# EAGLE board us_beacon_base_v3rf (EAGLE 6.5.0)
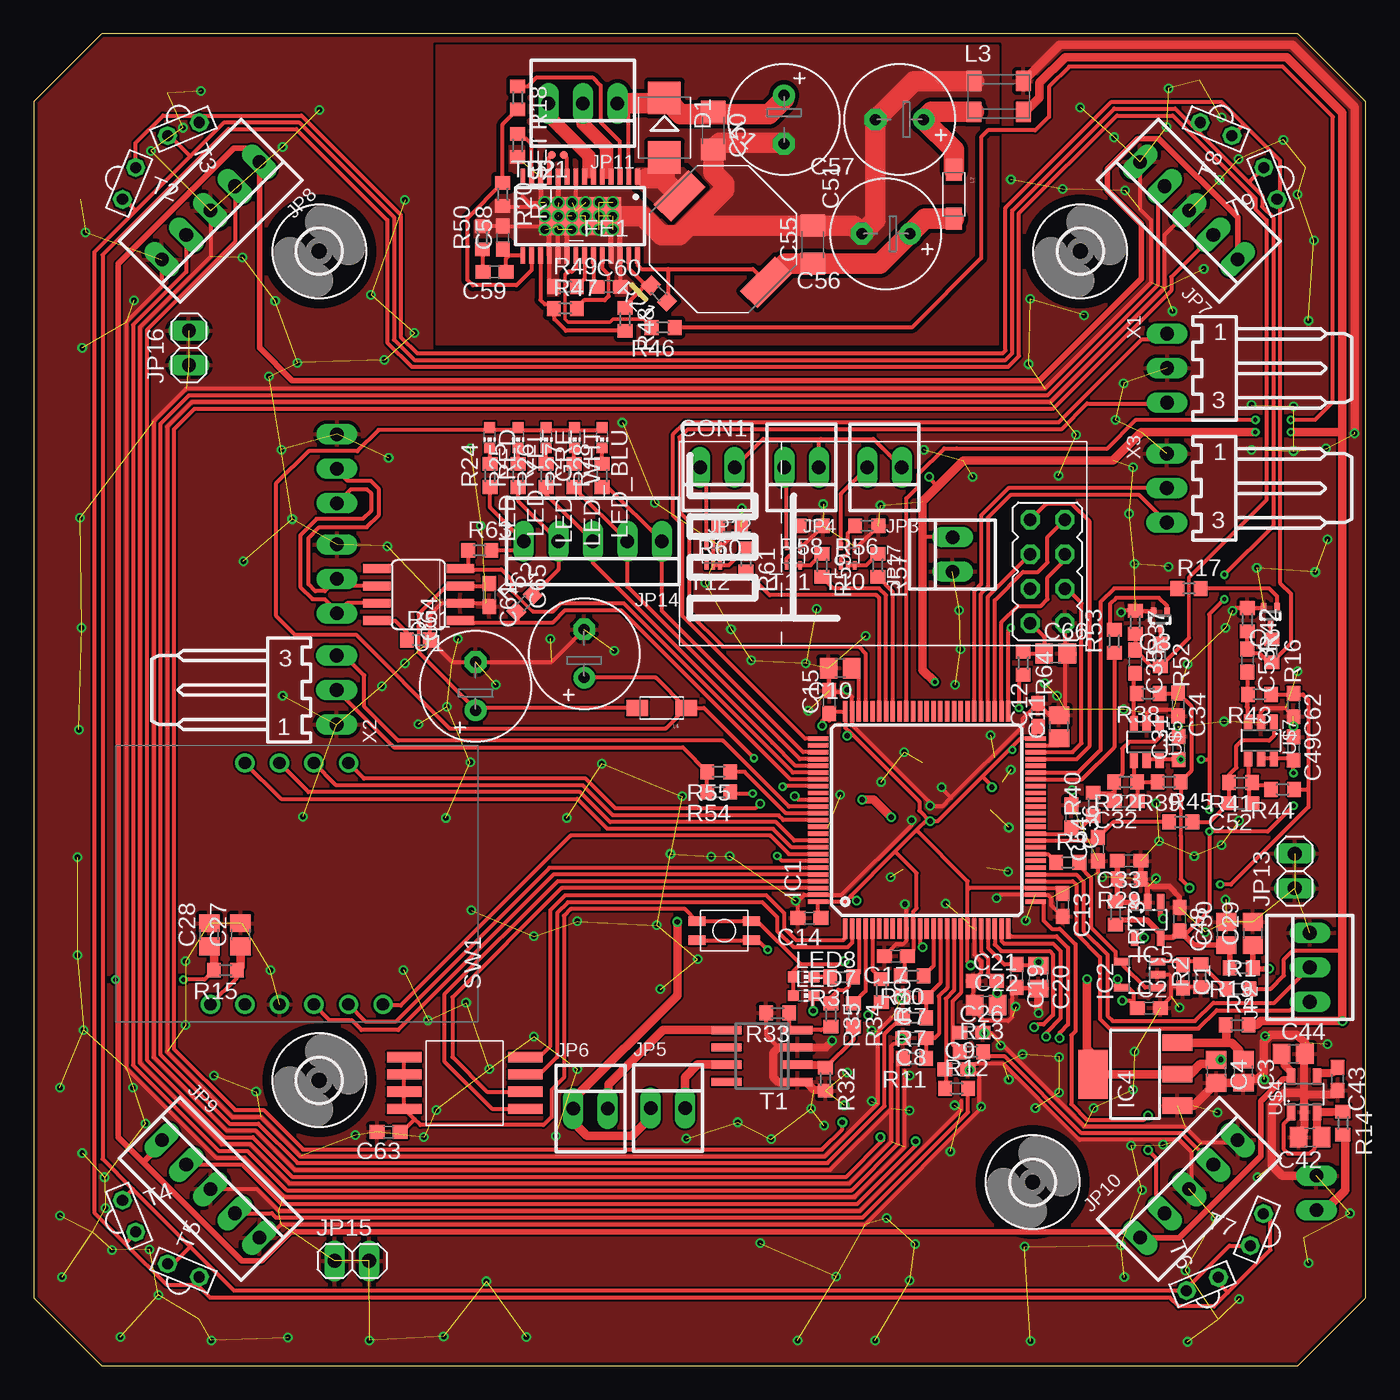
[diagram p6: board, top side]
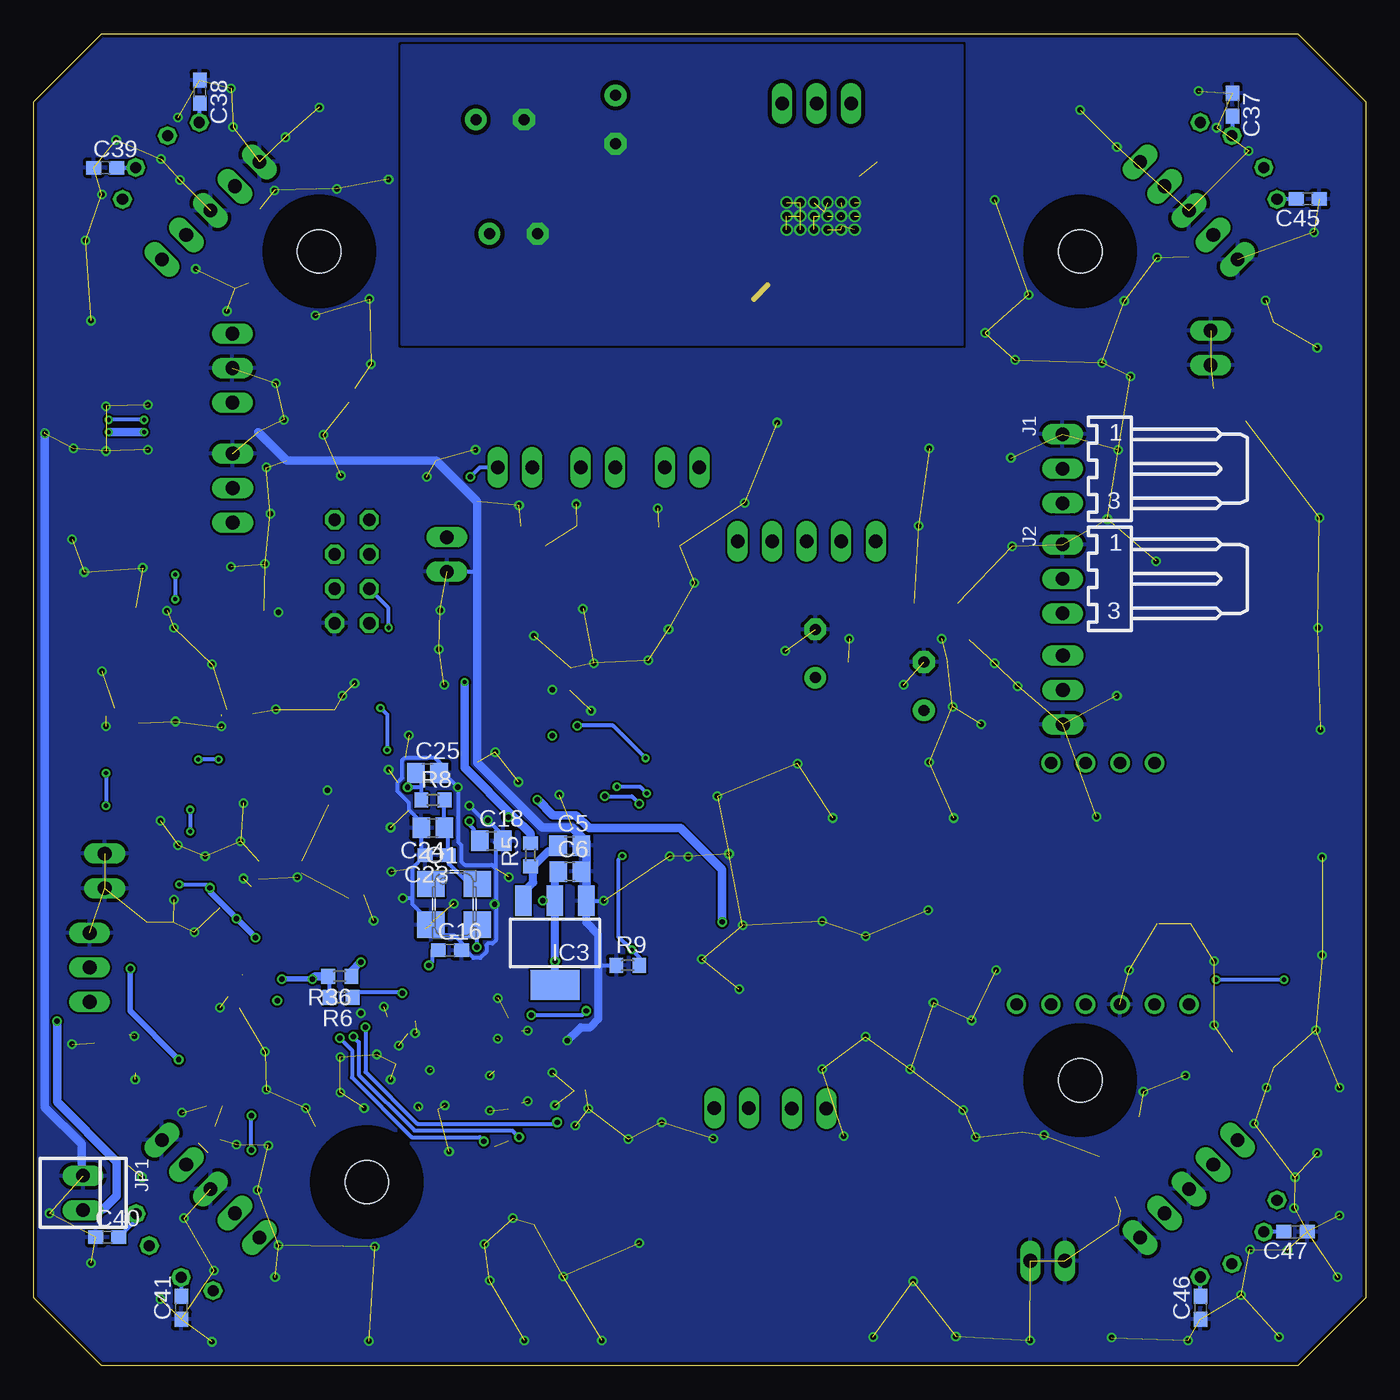
[diagram p7: board, bottom side, seen from below]

Size 98 x 98 mm. Coordinates in mm from the lower left corner, seen from the top.
Outline: 0,93 0,5 5,0 93,0 98,5 98,93 93,98 5,98 0,93
Copper layers (1*16): Top 0.035mm / dielectric 1.5mm / Bottom 0.035mm
Design rules "SeeedStudio_2layer_DRU_no_angle_20140221 *": minimum track width 6mil, minimum drill 0.3mm, track to track 6mil, track to pad 6mil, pad to pad 6mil, via to via 6mil, smd to smd 0mil, copper to edge 10mil, drill to drill 10mil, minimum pad ring 10mil, minimum via ring 6mil, stop-mask expansion 2mil, vias tented up to drill 100mil, thermal gap 10mil
Milling: 1 lines

## Footprints (pad centres in the part's own frame; a part is rotated, then mirrored left to right if it is on the bottom)
TSSOP28 = smd 0.35 x 1.2: 1 -4.225,-2.9; 2 -3.575,-2.9; 3 -2.925,-2.9; 4 -2.275,-2.9; 5 -1.625,-2.9; 6 -0.975,-2.9; 7 -0.325,-2.9; 8 0.325,-2.9; 9 0.975,-2.9; 10 1.625,-2.9; 11 2.275,-2.9; 12 2.925,-2.9; 13 3.575,-2.9; 14 4.225,-2.9; 15 4.225,2.9; 16 3.575,2.9; 17 2.925,2.9; 18 2.275,2.9; 19 1.625,2.9; 20 0.975,2.9; 21 0.325,2.9; 22 -0.325,2.9; 23 -0.975,2.9; 24 -1.625,2.9; 25 -2.275,2.9; 26 -2.925,2.9; 27 -3.575,2.9; 28 -4.225,2.9 | smd 6 x 2.8: PAD 0,0
3MMX3.5MM_BUTTON = smd 0.7 x 1.25: 1 -0.7,2; 2 0.7,2; 3 -0.7,-2; 4 0.7,-2
C0603 = smd 1.1 x 1: 1 -0.85,0; 2 0.85,0
C0805 = smd 1.3 x 1.5: 1 -0.85,0; 2 0.85,0
C1206 = smd 1.6 x 1.8: 1 -1.4,0; 2 1.4,0
E3,5-8 = drill 0.813 pad 1.6: + -1.778,0 | drill 0.813 pad 1.6 octagon: - 1.778,0
NRF24-MODULE = drill 0.914 octagon: 1 28.37,1.63; 2 25.83,1.63; 3 28.37,4.17; 4 25.83,4.17; 5 28.37,6.71; 6 25.83,6.71; 7 28.37,9.25; 8 25.83,9.25
SMB = smd 2.4 x 2.4: A 2.2,0; C -2.2,0
3,2 = hole 3.2: 0,0
TQFP100 = smd 1.5 x 0.33: 1 -8,6; 2 -8,5.5; 3 -8,5; 4 -8,4.5; 5 -8,4; 6 -8,3.5; 7 -8,3; 8 -8,2.5; 9 -8,2; 10 -8,1.5; 11 -8,1; 12 -8,0.5; 13 -8,0; 14 -8,-0.5; 15 -8,-1; 16 -8,-1.5; 17 -8,-2; 18 -8,-2.5; 19 -8,-3; 20 -8,-3.5; 21 -8,-4; 22 -8,-4.5; 23 -8,-5; 24 -8,-5.5; 25 -8,-6; 51 8,-6; 52 8,-5.5; 53 8,-5; 54 8,-4.5; 55 8,-4; 56 8,-3.5; 57 8,-3; 58 8,-2.5; 59 8,-2; 60 8,-1.5; 61 8,-1; 62 8,-0.5; 63 8,0; 64 8,0.5; 65 8,1; 66 8,1.5; 67 8,2; 68 8,2.5; 69 8,3; 70 8,3.5; 71 8,4; 72 8,4.5; 73 8,5; 74 8,5.5; 75 8,6 | smd 0.33 x 1.5: 26 -6,-8; 27 -5.5,-8; 28 -5,-8; 29 -4.5,-8; 30 -4,-8; 31 -3.5,-8; 32 -3,-8; 33 -2.5,-8; 34 -2,-8; 35 -1.5,-8; 36 -1,-8; 37 -0.5,-8; 38 0,-8; 39 0.5,-8; 40 1,-8; 41 1.5,-8; 42 2,-8; 43 2.5,-8; 44 3,-8; 45 3.5,-8; 46 4,-8; 47 4.5,-8; 48 5,-8; 49 5.5,-8; 50 6,-8; 76 6,8; 77 5.5,8; 78 5,8; 79 4.5,8; 80 4,8; 81 3.5,8; 82 3,8; 83 2.5,8; 84 2,8; 85 1.5,8; 86 1,8; 87 0.5,8; 88 0,8; 89 -0.5,8; 90 -1,8; 91 -1.5,8; 92 -2,8; 93 -2.5,8; 94 -3,8; 95 -3.5,8; 96 -4,8; 97 -4.5,8; 98 -5,8; 99 -5.5,8; 100 -6,8
SOT23-5 = smd 0.55 x 1.2: 1 -0.95,-1.3; 2 0,-1.3; 3 0.95,-1.3; 4 0.95,1.3; 5 -0.95,1.3
SOT223 = smd 1.219 x 2.235: 1 -2.311,-3.099; 2 0,-3.099; 3 2.311,-3.099 | smd 3.6 x 2.2: 4 0,3.099
7395-03 = drill 1.016 long: 1 -2.54,0; 2 0,0; 3 2.54,0
22-23-2021 = drill 1 long: 1 -1.27,0; 2 1.27,0
22-23-2031 = drill 1 long: 1 -2.54,0; 2 0,0; 3 2.54,0
22-23-2051 = drill 1 long: 1 -5.08,0; 2 -2.54,0; 3 0,0; 4 2.54,0; 5 5.08,0
1X02 = drill 1.016 long: 1 -1.27,0; 2 1.27,0
WE-TPC_1028/1038 = smd 3.6 x 1.8: 1 0,4.5; 2 0,-4.5
WE-CBF_1206(W=5.2) = smd 1.6 x 1.2: 1 -1.8,0; 2 1.8,0
WE-CNSW_1812 = smd 1.15 x 1.55: 1 -1.825,-1.125; 2 1.825,-1.125; 3 1.825,1.125; 4 -1.825,1.125
CHIP-LED0603 = smd 0.8 x 0.8: A 0,-0.75; C 0,0.75
XO53 = smd 1.93 x 2.032: 1 -1.5,-1.7; 2 1.5,-1.7; 3 1.5,1.7; 4 -1.5,1.7
SC75_INFINEON = smd 0.4 x 0.65: 1 -0.5,-0.575; 2 0,0.575; 3 0.5,-0.575
R0603 = smd 1 x 1.1: 1 -0.85,0; 2 0.85,0
416131160804 = smd 0.76 x 2.54: 1 0,-4.445; 2 1.27,-4.445; 3 2.54,-4.445; 4 3.81,-4.445; 5 3.81,4.445; 6 2.54,4.445; 7 1.27,4.445; 8 0,4.445
SO08 = smd 0.6 x 2.2: 1 -1.905,-2.6; 2 -0.635,-2.6; 3 0.635,-2.6; 4 1.905,-2.6; 5 1.905,2.6; 6 0.635,2.6; 7 -0.635,2.6; 8 -1.905,2.6
LPT80A = drill 0.813 octagon: C 0,-1.27; E 0,1.27
SOT563 = smd 0.279 x 0.6: 1 -0.5,-0.7; 2 0,-0.7; 3 0.5,-0.7; 4 0.5,0.7; 5 0,0.7; 6 -0.5,0.7
TP06R = smd 0.6 x 0.6: TP 0,0
SOIC-8 = smd 2.032 x 0.66: 1 -3.073,1.27; 2 -3.073,0; 3 -3.073,-1.27; 4 -3.073,-2.54; 5 3.073,-2.54; 6 3.073,-1.27; 7 3.073,0; 8 3.073,1.27
BNO055_BREAKOUT = drill 0.9: 3VO 9.525,1.27; ADR 17.145,19.05; GND 12.065,1.27; INT 14.605,19.05; PS0 9.525,19.05; PS1 12.065,19.05; RST 19.685,1.27; SCL 17.145,1.27; SDA 14.605,1.27; VIN 6.985,1.27
TSOT23-6 = smd 0.62 x 1.22: 1 -0.95,-1.3; 2 0,-1.3; 3 0.95,-1.3; 4 0.95,1.3; 6 -0.95,1.3
TSOT23-6' = smd 0.62 x 1.22: 1 -0.95,-1.3; 2 0,-1.3; 3 0.95,-1.3; 4 0.95,1.3; 5 0,1.3; 6 -0.95,1.3

## Placement (x,y rotation side)
_FE1  LT3599  [TSSOP28]  40.2,84.6 180 top
BT1  3MMX3.5MM_BUTTON  [3MMX3.5MM_BUTTON]  50.8,32 270 top
C1  100n  [C0603]  84.57,28.63 270 top
C2  100n  [C0603]  82.06,26.31 0 top
C3  10u  [C0805]  89.01,21.67 270 top
C4  10u  [C0805]  87.01,21.65 270 top
C5  10u  [C0805]  58.58,38.26 0 bottom
C6  10u  [C0805]  58.56,36.36 0 bottom
C7  1n  [C0603]  64.8,27.1 180 top
C8  1n  [C0603]  64.8,24.1 180 top
C9  1n  [C0603]  67.9,21.8 0 top
C10  2u2  [C0805]  59.33,51.33 180 top
C11  2u2  [C0805]  75.44,47.01 90 top
C12  100n  [C0603]  73.89,47.88 90 top
C13  100n  [C0603]  75.71,33.9 270 top
C14  100n  [C0603]  57.08,32.94 180 top
C15  100n  [C0603]  58.54,48.84 90 top
C16  100n  [C0603]  67.39,30.56 0 bottom
C17  100n  [C0603]  63.44,30.14 180 top
C18  10u  [C0805]  64.34,38.62 0 bottom
C19  100n  [C0603]  72.31,28.67 270 top
C20  10u  [C0805]  73.92,28.59 270 top
C21  100n  [C0603]  70,28.31 0 top
C22  10u  [C0805]  70.08,26.52 0 top
C23  100n  [C0603]  68.37,37.56 180 bottom
C24  10u  [C0805]  68.65,39.58 180 bottom
C25  10u  [C0805]  69.04,43.61 0 bottom
C26  1n  [C0603]  69,24.5 0 top
C27  10u  [C0805]  15.2,31.7 90 top
C28  10u  [C0805]  12.9,31.7 90 top
C29  10u  [C0805]  89.7,31.8 90 top
C30  10u  [C0805]  87.75,31.8 90 top
C31  100n  [C0603]  84.25,45.45 90 top
C32  [C0603]  80.35,41.55 180 top
C33  100n  [C0603]  80.6,37.15 180 top
C34  100n  [C0603]  84.2,48.65 270 top
C35  10n  [C0603]  81.05,51.8 270 top
C36  10n  [C0603]  76.35,40.4 270 top
C37  100n  [C0603]  9.8,92.8 270 bottom
C38  100n  [C0603]  85.8,93.75 270 bottom
C39  100n  [C0603]  92.75,88.15 0 bottom
C40  100n  [C0603]  92.6,9.45 0 bottom
C41  100n  [C0603]  87.15,4.25 90 bottom
C42  10u  [C0805]  93.92,16.81 180 top
C43  100p  [C0603]  95.94,21.09 270 top
C44  10u  [C0805]  92.68,22.94 0 top
C45  100n  [C0603]  4.25,85.85 180 bottom
C46  100n  [C0603]  12.15,4.25 90 bottom
C47  100n  [C0603]  5.15,9.85 180 bottom
C48  100n  [C0603]  84.3,32.85 270 top
C49  100n  [C0603]  92.7,45.4 270 top
C50  22u  [C1206]  50,90.9 270 top
C51  150u  [E3,5-8]  55.2,91.7 270 top
C52  [C0603]  88.8,41.4 180 top
C53  10n  [C0603]  89.3,51.9 270 top
C54  10n  [C0603]  78.3,38 90 top
C55  22u  [C1206]  57.3,82.5 90 top
C56  150u  [E3,5-8]  62.7,83.3 180 top
C57  150u  [E3,5-8]  63.7,91.7 180 top
C58  100p  [C0603]  34.5,83 90 top
C59  2n2  [C0603]  33.9,80.5 180 top
C60  2n2  [C0603]  42.3,79.4 0 top
C61  100n  [C0603]  33.5,56.7 270 top
C62  100n  [C0603]  92.7,48.6 270 top
C63  100n  [C0603]  26.1,17.2 180 top
C64  150u  [E3,5-8]  32.5,50 90 top
C65  150u  [E3,5-8]  40.5,52.4 90 top
C66  10u  [C0805]  75.2,52.4 0 top
CON1  NRF24-MODULE  [NRF24-MODULE]  47.5,53 0 top
D1  B250A-FDICT-ND  [SMB]  46.4,91.1 270 top
H5  MOUNT-HOLE3.2  [3,2]  21,21 0 top
H6  MOUNT-HOLE3.2  [3,2]  21,82 0 top
H7  MOUNT-HOLE3.2  [3,2]  77,82 0 top
H8  MOUNT-HOLE3.2  [3,2]  73.5,13.5 0 top
IC1  STM32F407VGT6  [TQFP100]  65.71,40.14 90 top
IC2  MCP6001T-I/OTCT-ND  [SOT23-5]  81.36,28.77 90 top
IC3  LM1117  [SOT223]  59.66,31.1 180 bottom
IC4  LM1117  [SOT223]  81.05,21.44 90 top
IC5  MCP6001T-I/OTCT-ND  [SOT23-5]  81.95,32.8 180 top
J1  CAN_3POLIG  [7395-03]  22.3,66 270 bottom
J2  CAN_3POLIG  [7395-03]  22.3,57.9 270 bottom
JP1  [22-23-2021]  94.38,12.7 270 bottom
JP2  [22-23-2031]  93.9,29.3 90 top
JP3  [22-23-2021]  62.6,66.1 180 top
JP4  [22-23-2021]  56.5,66.1 180 top
JP5  [22-23-2021]  46.65,18.95 0 top
JP6  [22-23-2021]  40.95,18.9 0 top
JP7  [22-23-2051]  85,85 135 top
JP8  [22-23-2051]  13,85 225 top
JP9  [22-23-2051]  13,13 315 top
JP10  [22-23-2051]  85,13 45 top
JP11  [22-23-2031]  40.4,92.9 180 top
JP12  [22-23-2021]  50.3,66.1 180 top
JP13  [1X02]  92.8,36.4 90 top
JP14  [22-23-2051]  41.13,60.67 180 top
JP15  [1X02]  23.4,7.7 0 top
JP16  [1X02]  11.4,74.9 90 top
JP17  [22-23-2021]  67.6,59.7 90 top
L1  WE-TPC_1028/1038  [WE-TPC_1028/1038]  50.7,82.9 225 top
L2  Wuert 742 792 18  [WE-CBF_1206(W=5.2)]  67.7,86.2 270 top
L3  wuerth 744 235 601  [WE-CNSW_1812]  71,93.4 180 top
L4  Wuert 742 792 18  [WE-CBF_1206(W=5.2)]  46.2,48.4 180 top
LED7  [CHIP-LED0603]  56.66,27.22 270 top
LED8  [CHIP-LED0603]  56.66,28.6 270 top
LED_BLU  [CHIP-LED0603]  41.81,68.29 180 top
LED_GRE  [CHIP-LED0603]  37.7,68.29 180 top
LED_RED  [CHIP-LED0603]  33.54,68.29 180 top
LED_WHT  [CHIP-LED0603]  39.78,68.29 180 top
LED_YEL  [CHIP-LED0603]  35.62,68.29 180 top
Q1  [XO53]  67.08,33.94 270 bottom
Q2  RUM003N02  [SC75_INFINEON]  91,55.2 180 top
Q3  RUM003N02  [SC75_INFINEON]  82.9,54.9 180 top
R1  20k  [R0603]  88.61,27.72 0 top
R2  6k8  [R0603]  85.88,28.7 90 top
R3  1k  [R0603]  76.09,37.02 0 top
R4  445-1550-1-ND  [R0603]  88.55,25.06 0 top
R5  445-1550-1-ND  [R0603]  61.46,37.58 90 bottom
R6  445-1550-1-ND  [R0603]  75.4,27.1 180 bottom
R7  50  [R0603]  64.8,25.6 180 top
R8  445-1550-1-ND  [R0603]  68.63,41.62 0 bottom
R9  560  [R0603]  54.29,29.46 0 bottom
R10  1k  [R0603]  64.63,28.69 180 top
R11  50  [R0603]  64.8,22.6 180 top
R12  50  [R0603]  67.9,20.4 0 top
R13  50  [R0603]  69,23.1 0 top
R14  445-1550-1-ND  [R0603]  96.34,17.84 270 top
R15  445-1550-1-ND  [R0603]  14.1,29.1 180 top
R16  510  [R0603]  91.1,52.6 270 top
R17  1k  [R0603]  85,57.2 0 top
R18  1Meg  [R0603]  35.6,93.3 270 top
R19  ferrite  [R0603]  88.85,29.25 180 top
R20  33k  [R0603]  34.5,86.2 270 top
R21  33k  [R0603]  46,78.9 135 top
R22  20k  [R0603]  80.35,42.95 180 top
R23  4k7  [R0603]  79.6,33.3 270 top
R24  1k  [R0603]  33.57,65.5 90 top
R25  1k  [R0603]  35.63,65.5 90 top
R26  1k  [R0603]  37.69,65.5 90 top
R27  1k  [R0603]  39.75,65.5 90 top
R28  680  [R0603]  41.81,65.5 90 top
R29  4k7  [R0603]  80.6,35.8 180 top
R30  [R0603]  62.37,27.6 270 top
R31  [R0603]  59.45,28.59 180 top
R32  100k  [R0603]  58.25,21.08 270 top
R33  100k  [R0603]  54.73,25.94 180 top
R34  1k  [R0603]  60.3,25.8 270 top
R35  1k  [R0603]  58.65,25.8 270 top
R36  445-1550-1-ND  [R0603]  75.5,28.65 180 bottom
R37  4k7  [R0603]  81.05,54.7 270 top
R38  10k  [R0603]  82,49.45 180 top
R39  10k  [R0603]  83.55,42.95 180 top
R40  1k  [R0603]  77.95,41.3 90 top
R41  20k  [R0603]  88.8,42.9 180 top
R42  4k7  [R0603]  89.3,54.9 270 top
R43  10k  [R0603]  90.2,49.4 180 top
R44  10k  [R0603]  91.9,42.4 180 top
R45  1k  [R0603]  84.4,40 0 top
R46  1k  [R0603]  46.3,76.4 180 top
R47  47k  [R0603]  39.1,77.8 0 top
R48  10k  [R0603]  43.5,77 270 top
R49  47k  [R0603]  39.1,79.4 0 top
R50  10k  [R0603]  33,83 90 top
R51  4k7  [R0603]  28.3,53.4 0 top
R52  510  [R0603]  82.9,52.3 270 top
R53  1k  [R0603]  79.5,53.3 90 top
R54  100  [R0603]  50.4,42.2 180 top
R55  100  [R0603]  50.4,43.7 180 top
R56  33  [R0603]  61.3,61.8 180 top
R57  10k  [R0603]  62.1,58.9 270 top
R58  33  [R0603]  57.2,61.8 180 top
R59  10k  [R0603]  58,58.9 270 top
R60  33  [R0603]  51.2,61.7 180 top
R61  10k  [R0603]  52.4,59.3 270 top
R62  [R0603]  36.1,56.1 45 top
R63  [R0603]  32.8,60 0 top
R64  445-1550-1-ND  [R0603]  72.8,51.7 270 top
R_ISET  27k  [R0603]  35.6,89.8 270 top
SW1  416131160804  [416131160804]  31.7,22.7 270 top
T1  IRF7313  [SO08]  53.58,22.78 90 top
T2  TEFT4300  [LPT80A]  7,87 337.5 top
T3  TEFT4300  [LPT80A]  11,91 292.5 top
T4  TEFT4300  [LPT80A]  7,11 22.5 top
T5  TEFT4300  [LPT80A]  11,7 67.5 top
T6  TEFT4300  [LPT80A]  86,6 112.5 top
T7  TEFT4300  [LPT80A]  90,10 157.5 top
T8  TEFT4300  [LPT80A]  87,91 247.5 top
T9  TEFT4300  [LPT80A]  91,87 202.5 top
T10  PMBT3904VS  [SOT563]  59.9,59.6 180 top
T11  PMBT3904VS  [SOT563]  55.9,59.6 180 top
T12  PMBT3904VS  [SOT563]  50,59.6 180 top
TP1  TPTP06R  [TP06R]  39,89.1 180 top
TP2  TPTP06R  [TP06R]  38.1,89.1 180 top
U1  SN65HVD230  [SOIC-8]  28.3,56.1 180 top
U$1  BNO055_ADAFRUIT_BREAKOUT  [BNO055_BREAKOUT]  6,25.3 0 top
U$4  AP2210K-5.0  [TSOT23-6]  93.48,19.97 0 top
U$5  MAX4488  [TSOT23-6']  81.9,45.9 180 top
U$7  MAX4488  [TSOT23-6']  90.3,46 180 top
X1  SWDABGEWINKELT  [7395-03]  83.4,73.4 270 top
X2  SERIAL_DEBUG_3PINL  [7395-03]  22.27,49.72 90 top
X3  SERIAL_DEBUG_3PINL  [7395-03]  83.38,64.57 270 top

## Tracks (layer width: path | path; a pad name or v marks a point on that pad's centre or on a via)
3V3_CAN
  Top 0.25: 28.3,54.4 28.3,52.5
  Top 0.3: C61.1 33.32,57.37 U1.3 30.37,57.37 28.3,55.3 28.3,54.4 | 28.3,52.5 32.55,48.25 32.53,48.25 C64.+ 32.68,48.4 L4.2
+3V3_ANALOG  (via drill 0.4)
  Top 0.3: IC2.5 80.53,27.82 80.9,27.45 80.9,26.62 C2.1 | 81.12,26.4 C2.1 | C2.1 80.67,26.85 v80.1,26.85
  Top 0.406: C29.1 R19.1 89.75,29.2 v90.9,29.2 | v87.35,22.5 C4.1 | v79.75,28.45 79.75,28.13 IC2.5
  Top 0.6: 86.67,22.14 C4.1 | 78.1,22.69 78.02,22 IC4.4
  Top 0.61: C4.1 86.71,22.2 85.85,22.2 85.09,21.44 IC4.2 78.58,21.44 78.02,22 | 78.1,22.69 77.5,23.29 v77.5,28.45
  Bottom 0.3: R6.2 76.25,28.55 R36.2
  Bottom 0.406: v90.9,29.2 90.9,26.1 v87.35,22.5 | v77.5,28.45 v79.75,28.45
  Bottom 0.6: 76.55,28.85 R36.2
  Bottom 0.61: v77.5,28.45 77.3,28.65 R36.2
+3V3_DIGITAL  (via drill 0.3, 0.4)
  Top 0.3: 60.12,34.58 59.69,34.14 IC1.100 57.71,32.94 C14.1 | 60.12,34.58 63.38,37.83 | 63.38,37.83 64.95,39.4 | 64.95,39.4 65.78,40.23 v65.95,40.05 | C12.1 73.71,47.31 IC1.50 72.59,46.14 71.72,45.27 | 63.38,37.83 64.95,36.25 64.95,33.65 64.71,33.41 IC1.11 64.71,30.56 C17.1 64.08,29.93 64.08,28.99 R10.2 | 68.71,35 IC1.19 68.71,29.69 v68.95,29.45 | 58.54,47.46 C15.1 58.69,48.14 IC1.75 59.71,46.94 60.08,46.58 | 71.72,45.27 69.8,43.35 | v70.5,42.55 70.5,42.65 69.8,43.35 | 68.71,35 68.85,35.14 IC1.28 75.32,35.14 C13.1 76.06,35.1 | v60.55,34.2 60.5,34.2 60.12,34.58 | LED7.A LED8.A 55.91,29.06 56.4,29.55 | 60.08,46.58 65.15,41.5 65.15,40.85 v65.95,40.05 | v59.85,46.35 60.08,46.58 | 56.4,29.55 59.45,29.55 v59.65,29.75 | 69.8,43.35 66.5,40.05 v65.95,40.05 | 68.71,35 68.71,35.64 64.95,39.4 | SW1.1 SW1.2 SW1.3 SW1.4 28.02,18.12 | v53,44.7 49.3,48.4 L4.1 | 56.4,29.55 53.25,32.7 BT1.1 BT1.3 47.9,33.6 39.5,33.6 39,33.1 39,21.2 38.1,20.3 38.1,18.3 37.5,17.7 28.45,17.7 28.02,18.12 | C63.1 27.1,17.2 28.02,18.12 | 35.6,68.85 33.73,68.85 | 33.73,68.85 LED_RED.A | L4.1 45.78,50.62 C65.+ | 33.73,68.85 25.35,68.85 23.8,67.3 20.2,67.3 17.8,64.9 17.8,55.2 19.2,53.8 23.7,53.8 30.6,46.9 46.5,46.9 L4.1 | R64.2 72.5,50.55 v72.5,48.4 | v72,45.3 71.72,45.27
  Top 0.305: 37.65,68.85 35.6,68.85 arc90 35.62,68.87 LED_YEL.A | 37.65,68.85 39.59,68.85 arc90 LED_WHT.A 39.97,68.85 41.62,68.85 LED_BLU.A 42,68.85 | LED_GRE.A 37.7,68.9 arc-90 37.65,68.85 | 58.69,48.14 58,47.45 v58,47.1
  Bottom 0.3: C25.1 69.48,43.62 R8.1 69.48,42.55 v70.5,42.55 | 65.54,38.84 C18.1 65.65,39.08 65.65,39.5 65.95,39.8 v65.95,40.05 | C16.1 68.69,30.56 68.69,29.71 v68.95,29.45 | IC3.2 v60.55,34.2 | IC3.4 v59.66,29.74 v59.65,29.75 | v53,44.7 55.4,47.1 v58,47.1 | v72.5,48.4 72,47.9 v72,45.3
  Bottom 0.305: v58,47.1 57.95,47.05
  Bottom 0.6: IC3.4 IC3.2 59.66,36.11 C6.1
+5V  (via drill 0.3)
  Top 0.3: R15.2 12.55,28.4 v11,28.4 | v6,28.4 6.2,28.4
  Top 0.406: JP7.1 88.59,84.51 82.8,90.3 81.25,90.3 79,88.05 79,86.5 81.5,84 81.5,80 74,72.5 19,72.5 16.59,74.91 JP8.1 15.58,89.6 14.7,89.6 6.2,81.1 6.2,28.4 6.2,16.8 8.05,14.95 | JP9.1 9.41,16.31 8.05,14.95 | U$4.6 92.36,21.1 91.95,21.1 90.3,19.45 90.3,15.4 84.31,9.41 JP10.1 80.97,9.85 18.9,9.85 16.75,7.7 15.3,7.7 8.05,14.95
  Top 0.6: U$4.6 92.53,21.62 92.05,22.1 92.05,22.97 C44.1
  Top 0.61: R15.2 13.25,30.5 C28.1 12.85,30.8
  Bottom 0.3: v11,28.4 v6,28.4
+UB  (via drill 0.3, 0.4)
  Top 0.3: R1.2 91.02,27.72 92,28.7 92,29.9 92.65,30.55 96.3,30.55 | JP12.1 53.67,68.2 57.9,68.2 | 57.9,68.2 61.77,68.2 JP3.1 | JP4.1 57.77,68.07 57.9,68.2 | 96.3,30.6 96.3,30.5 | JP17.2 65.43,60.97 65.4,61
  Top 0.305: v65.9,65.4 65.9,65.3 66.5,64.7
  Top 0.61: JP1.2 94.55,11.6 95.2,11.6 96.5,12.9 96.5,16.83 R14.2 | R4.2 90.01,25.06 90.3,25.35 v96.3,25.35 96.3,30.5 96.3,30.55 | v63.1,40.35 61.8,41.65 v60.95,41.65 | L3.4 72.97,92.28 74,93.3 74,94.4 75.9,96.3 92.2,96.3 96.3,92.2 96.3,68.7 | 96.3,68.7 96.3,30.6 | v66.3,50.3 65.4,51.2 65.4,61 65.4,63.6 66.5,64.7 68.4,66.6 79.4,66.6 81.5,68.7 v89.9,68.7 | v92.5,68.7 96.3,68.7 | JP5.1 45.38,18.28 44,16.9 40.7,16.9 39.7,17.9 39.7,18.88 JP6.1 39.68,19.58 47.35,27.25 v47.35,32.65 47.35,32.7
  Bottom 0.3: JP3.1 63.9,66.1
  Bottom 0.305: 63.9,66.1 65.2,66.1 v65.9,65.4
  Bottom 0.61: R5.2 61.46,39.16 62.69,40.38 | JP1.2 94.31,11.5 92.9,11.5 91.9,12.5 91.9,15 96.3,19.4 v96.3,25.35 | 62.69,40.38 62.72,40.35 v63.1,40.35 | v60.95,41.65 59.8,40.5 58.1,40.5 57.15,39.55 50.4,39.55 47.35,36.5 v47.35,32.65 | 62.69,40.38 66.3,44 v66.3,50.3 | v89.9,68.7 v92.5,68.7
ADC_BAT
  Top 0.3: IC1.33 74.62,37.64 R3.1
ADC_OPTO_SYNC_BACK
  Top 0.3: IC1.35 78.09,38.64 C54.2 79.45,40 R45.1
ADC_OPTO_SYNC_FRONT
  Top 0.3: IC1.36 75.94,39.14 C36.2 77.05,39.55 R40.1
ADR  (via drill 0.4 pad 0.4)
  Top 0.3: IC1.85 56.26,41.64 v56,41.9 | v53.45,41.35 53.1,41 42.8,41 40.6,43.2 24.3,43.2 U$1.ADR
  Bottom 0.3: v56,41.9 54,41.9 v53.45,41.35
AMP1  (via drill 0.4 pad 0.4)
  Top 0.3: IC1.23 70.71,30.99 71.2,30.5 74.75,30.5 75,30.25 75,25.8 74.3,25.1 73.8,25.1 v73.6,24.9 | v59.5,17.9 59.5,17.4 58,15.9 19.8,15.9 16.9,18.8 14.8,18.8 10.3,23.3 10.3,68.9 11.8,70.4 75,70.4 83.7,79.1 83.7,80.11 JP7.2
  Bottom 0.3: v73.6,24.9 73.6,21.6 69.8,17.8 59.6,17.8 v59.5,17.9
AMP2  (via drill 0.4 pad 0.4)
  Top 0.3: IC1.24 71.21,31.24 71.4,31.05 75,31.05 75.55,30.5 75.55,25.55 74.5,24.5 v74.5,24.2 | JP8.2 14.8,82.7 8.3,76.2 8.3,22.5 14,16.8 16.1,16.8 19,13.9 59.8,13.9 62.5,16.6 | v62.3,16.8 62.3,16.4
  Top 0.305: 62.5,16.6 v62.3,16.8
  Bottom 0.3: v74.5,24.2 74.1,23.8 74.1,21.4 70,17.3 62.8,17.3 v62.3,16.8
AMP3  (via drill 0.4 pad 0.4)
  Top 0.3: IC1.25 71.71,31.79 71.9,31.6 75.25,31.6 76.1,30.75 76.1,25.1 75.5,24.5 v75.5,24.1 | JP9.2 15.3,14.8 18.2,11.9 60.6,11.9 64.9,16.2 v64.9,16.5
  Bottom 0.3: v75.5,24.1 74.6,23.2 74.6,21.2 70.2,16.8 65.2,16.8 v64.9,16.5
AMP4  (via drill 0.4 pad 0.4)
  Top 0.3: IC1.26 74.16,34.14 74.3,34 74.3,32.75 74.9,32.15 75.5,32.15 76.65,31 76.65,24.6 76.35,24.3 76.35,19.25 77.5,18.1 81.7,18.1 v82,18.4 | JP10.2 82.6,11.81 82.6,15.25 v82,15.85
  Bottom 0.3: v82,15.85 v82,18.4
DAC1/I2S1_WS
  Top 0.3: IC1.29 76.46,35.64 76.7,35.4 76.7,31.8 78.45,30.05 78.45,25.5 79.15,24.8 85.7,24.8 87.05,26.15 92.45,26.15 93.06,26.76 JP2.1 93.86,26.8 92.6,26.8
DAC2/SPI1_SCK
  Top 0.3: IC1.30 76.71,36.14 77.25,35.6 77.25,32 79,30.25 79,25.75 79.4,25.35 85.45,25.35 86.8,26.7 91.3,26.7 JP2.2
DCDC_SW_NODE
  Top 0.3: 45.1,87.4 45,87.5 _FE1.1
  Top 1.5: D1.A 46.4,87.2 L1.2 46.2,87.4 45.1,87.4
  pour Top (no thermals): 46.5,84.8 44.45,86.85 44.45,88.1 47.75,88.1 48.75,87.1 48.75,87.05
GND  (via drill 0.4, 0.4 pad 0.4)  (270 unrouted)
  Top 0.3: 59.85,49.55 60.21,49.19 IC1.74 60.21,47.19 65.95,41.45 v65.95,41.2 66.9,41.2 67.5,41.8 | 59.85,49.55 58.68,49.55 C15.2 58.54,51.19 C10.2 | C14.2 56.23,34.18 | 56.23,34.18 56.69,34.64 IC1.99 59.44,34.64 64.6,39.8 v64.6,40.15 | C11.2 74.81,47.81 C12.2 72.75,47.59 72.75,47.05 67.5,41.8 | 67.5,41.8 66.8,42.5 v66.8,42.55 | C17.2 63.45,31 63.95,31 64.21,31.26 IC1.10 64.21,33.59 v64.1,33.95 | C13.2 75.15,33.6 74.85,33.9 74.85,34.4 74.61,34.64 IC1.27 71.09,34.64 v70.85,34.4 | 55,23.4 56.16,23.4 T1.3 | C11.2 | v56.05,34.2 56.25,34.21 56.23,34.18 | R33.2 53.88,24.32 54.8,23.4 | v59.85,49.75 59.85,49.55 | C61.2 33.25,56.1 U1.2 30,56.1 29.15,55.25 R51.2 30.77,51.78 C64.- 38.1,51.78 C65.- | IC1.20 69.21,30.24 69.7,29.75 69.7,28.91 C21.1 69.1,26.55 C22.1 69.35,26.3 69.35,25.95 69.95,25.35 71.7,25.35 72,25.65 72,27.51 C19.2 | C20.2 72.39,27.74 C19.2 | C19.2 72.31,27.61 | C2.2 82.91,26.36 83.7,27.15 83.7,27.9 | 83.7,27.9 83.7,28.1 | 83.7,28.1 83.7,28.6 83.55,28.75 82.68,28.75 | 83.72,28.08 83.7,28.1 | R2.1 84.5,27.85 | 84.5,27.85 83.75,27.85 83.7,27.9 | C1.2 84.5,27.85 | JP8.5 9.41,79.41 6.8,76.8 6.8,21.9 13.4,15.3 15.5,15.3 18.4,12.4 60.4,12.4 64.1,16.1 64.1,21.7 | JP8.3 13,81.6 7.8,76.4 7.8,22.3 13.8,16.3 15.9,16.3 18.8,13.4 60,13.4 63.1,16.5 63.1,18.9 | JP9.5 16.9,9.1 18.2,10.4 61.2,10.4 69.6,18.8 69.6,21.3 69.4,21.5 69.1,21.5 v68.85,21.75 69.3,22.2 71.35,22.2 76.95,16.6 84.3,16.6 85.2,15.7 85.2,13.2 JP10.3 | JP9.3 16.4,13 18,11.4 60.8,11.4 68.25,18.85 68.25,19.45 | JP10.5 88.4,16.4 85.9,16.4 84.7,17.6 77.3,17.6 70.45,24.45 v69.95,24.45 | 63.1,18.9 63.1,23.5 63.3,23.7 63.5,23.7 v63.85,24.05
  Top 0.3: 63.1,18.9 58.6,14.4 19.2,14.4 16.3,17.3 14.2,17.3 8.8,22.7 8.8,69.5 11.2,71.9 74.4,71.9 82.2,79.7 82.2,84.3 81.41,85.09 JP7.5 | 63.1,25.6 62.1,24.6 62.1,19.3 58.2,15.4 19.6,15.4 16.7,18.3 14.6,18.3 9.8,23.1 9.8,69.1 11.6,70.9 74.8,70.9 83.2,79.3 83.2,83.2 JP7.3 | U$5.2 81.9,48 82.2,48.3 83.8,48.3 84.2,47.9 84.2,46.95 C31.2 | Q2.3 90.58,55.75 R42.1 88.4,55.75 v88.2,55.55 | U$7.2 90.3,48.1 90.6,48.4 92.1,48.4 92.7,47.8 C49.1 | Q3.3 81.12,55.48 R37.1 80.1,55.55 v80,55.45 | C36.1 76.35,42.3 v76.4,42.35 | C54.1 78.3,36.25 v78.6,35.95 | T10.1 60.65,60.3 R56.1 | T11.1 56.55,60.3 R58.1 | T12.1 50.65,60.3 R60.1 | CON1.1 75.87,52.5 | 75.87,52.5 75.87,48.29 C11.2 | C66.2 75.95,52.5 75.87,52.5
  Top 0.406: C48.1 84.3,34.5 83.55,35.25 82,35.25 | 82,35.25 R29.1 C33.1 | IC5.2 81.95,35.2 82,35.25
  Top 0.6: 56.16,20.85 56.85,20.85 57.4,20.3 58.18,20.3 R32.2 | 56.16,23.4 54.8,23.4 54.4,23 54.4,21.25 54.8,20.85 56.16,20.85 | 56.16,20.85 T1.1 | T1.3 58.27,23.41 v58.75,23.9 | 93.55,19.8 93.48,19.73 U$4.2 93.48,17.22 C42.2 | 93.55,19.8 93.7,19.95 95.65,19.95 C43.2 | 93.45,19.9 93.55,19.8 | C44.2 93.45,23.11 93.45,19.9 | 73.92,27.42 C20.2 | 93.3,20.05 93.45,19.9
  Top 0.61: L3.1 75.5,97.2 92.6,97.2 97.2,92.6 v97.2,68.6 | C44.2 93.5,23.22 93.55,23.75 92.95,24.35 91,24.35 90.5,23.85 90.5,21.55 90.05,21.1 89.29,21.1 C3.2 88.99,20.8 C4.2 85.34,19.13 IC4.1 | 93.3,20.05 92.05,20.05 91.1,19.1 91.1,14.73 91.86,13.97 JP1.1 | 73.92,27.42 73.92,25.98 v73.95,25.95 | C27.2 15.31,32.55
  Bottom 0.3: v65.95,41.2 64.9,40.15 v64.6,40.15 63.79,39.34 C18.2 | 64,36.55 64.3,36.85 66.3,36.85 66.55,37.1 66.55,38.3 66.75,38.5 66.75,42.5 v66.8,42.55 67.74,43.49 C25.2 67.74,43.91 67.7,43.95 68.5,44.75 70.7,44.75 70.9,44.55 70.9,43.25 71.25,42.9 71.25,42.25 70.4,41.4 70.4,40.9 69.85,40.35 69.85,39.6 69.83,39.58 C24.2 69.5,37.5 69.6,37.5 | 64,36.55 64,34.15 | 64,34.15 64,31.3 64.25,31.05 64.6,31.05 64.7,30.95 64.7,30.45 65.15,30 65.65,30 66.15,30.5 | 66.15,30.5 66.15,30.75 67.05,31.65 67.99,31.65 Q1.2 68.78,32.58 70.15,33.95 70.15,34.4 | 70.15,34.4 70.15,36.63 C23.2 | v64.1,33.95 64,34.15 | 64,36.55 64,38.4 64.1,38.5 | C16.2 66.21,30.56 66.15,30.5 | IC3.1 56.25,34.2 v56.05,34.2 | v70.85,34.4 70.15,34.4 | 57.25,37.5 57.35,37.4 | R9.1 55.2,29.4 56.45,29.4 | JP17.1 65.47,58.43 65.4,58.5
  Bottom 0.6: 57.35,36.25 57.35,35.39 IC3.1 57.35,32.6 56.45,31.7 56.45,29.4 56.45,25.5 57.05,24.9 57.75,24.9 v58.75,23.9 | 57.35,36.25 57.35,37.4 57.35,37.88 C5.2 | C6.2 57.46,36.36 57.35,36.25
  Bottom 0.61: 57.35,35.39 57.35,37.4 57.35,38.55 58.4,39.6 60.6,39.6 65.4,44.4 65.4,58.5 65.4,63.6 68.4,66.6 79.4,66.6 81.5,68.7 | JP1.1 94.5,14.09 94.5,16.3 97.2,19 97.2,68.7
  other vias: 51.2,37.5 57.2,18.9 59.85,21.55 51.8,17.9 46.1,27.7 45.85,32.4 48.85,29.9 46.85,37.65 49.85,37.45 17.3,72.8 17.75,78.35 64.05,45.15 62.35,42.95 59.35,42 70.4,46.4 71.9,43.85 71.7,36.35 67.1,34 63.05,35.95 71.75,39.6 63.85,27.05 15.35,81.55 11.15,29.75 11.15,25.05 13.25,21.35 16.35,20.15 48,16.7 54.25,16.65 58.15,17.65 59.65,19.15 61.65,24.65 61.65,19.45 64.45,21.35 64.45,18.75 67.75,19.15 87.25,87.25 83.35,91.15 7.35,78.4 7.3,20.45 8.2,17.8 53.45,9 64.85,8.95 80,8.85 86.95,10.85 90.05,13.85 62.75,10.85 67.45,15.75 73.7,18.95 80.75,16.2 83.1,16.25 81.55,12.9 71.75,21.05 69.7,19.05 71.15,23.55 72.75,22.9 72.25,26.4 3.55,74.9 91.95,90.2 87.4,91.85 88.65,88.8 93,86.2 94.2,82.8 3.65,24.7 1.9,20.45 3.55,15.65 1.9,11.05 2.05,6.5 6.35,2.1 5.75,8.5 9.15,5.2 13.05,1.85 36.25,2.1 30.15,2.15 18.7,2.05 24.7,1.85 33.3,6.2 59.05,6.55 64.45,6.25 56.2,1.85 61.9,1.85 73.35,1.8 84.9,1.75 88.7,4.9 93.8,7.55 84.3,26.35 90.6,24.25 95.2,23.65 90.55,21.05 75.45,22.7 75.45,20.1 78,18.95 80.9,20.3 81,23.1 73,32.75 84.75,7 80.25,6.5 72.9,8.75 8.5,8.55 5.25,11.6 5.2,13.85 8.6,89.4 10.95,91.1 96.85,11.2 84.2,47.05 92.7,47.05 82.6,35.85 23.65,16.95 52.1,63.1 58.1,63.4 62.3,63.3 40,21.8 40,32.7 36.8,31.6 31.8,26.7 33.5,21.8 36.8,24.2 38.4,16.9 28.7,16.8 29.6,18.8 29,25.4 3.2,30.2 3.2,37.4 3.3,46.8 3.5,54.3 3.4,62.4 3.8,83.4 18.3,89.7 24.8,78.8 25.8,74 19.4,73.8 12.3,93.8 21,92.4 27.3,85.8 28,76 73.2,73.7 73.3,78.5 77.3,77.3 75.7,86.6 79.5,90.4 80.3,86.5 86.1,80.7 71.9,87.3 77,92.6 83.5,94 93.8,76.9 92.7,70.6 89.6,70.7 89.6,67.4 92.7,67.3 83.8,77.6 80.2,72.3 79.6,69.6 76.7,68.5 65.5,67.4 80.9,66.1 69.1,65.4 75.4,65.5 95.1,67.5 95.2,60.8 90,58.7 80.6,62.7 87.7,54.3 84.9,51.6 87.6,47.4 93,51.1 94.3,58.4 83.5,58.8 81,59 75.3,49.3 74.4,50.2 68.2,52.7 80.2,48.3 82.6,41.4 88.7,40.1 87.4,38.3 85.4,37.5 82.8,38.6 87.7,34.3 86.2,31.9 87.1,18.6 39.2,40.3 30.3,40.3 19.8,40.4 17.4,29.1 27.2,29.1 32.2,33.5 18.3,49.3 15.4,59.2 19,62.3 18.2,67.4 26.1,66.8 26,60.3 32.1,67.5 32.9,61.8 43.3,69.4 45.7,63.5 34,50.1 42.7,52.6 31.2,53.5 38,53.5 25.6,50 28.3,47.2 27.3,51.7 30.4,48.5 47.7,41.9 41.8,44.3 32.1,44.4 57,48.2 52.8,51.9 56.8,51.7 49.4,57.6 51.3,54.2 57.6,55.7 61.2,53.7 67.8,50.1 68.1,55.6
  pour Top (isolate 0.1, rank 3): -1,99 -1.5,-1.5 98.5,-1.5 99,99
  pour Bottom (isolate 0.1, rank 3): -1,99 -1.5,-1.5 98.5,-1.5 99,99
GNDI  (via drill 0.6)  (18 unrouted)
  Top 0.3: _FE1.26 43.12,79.42 C60.2 | _FE1.19 38.58,83.9 | 38.58,83.9 38.58,84.08 39.1,84.6 | _FE1.18 37.92,79.72 R49.1 | _FE1.8 39.88,84.92 _FE1.PAD | 35.98,86.03 36.4,85.6 37.27,85.6 | 35.98,88.58 R_ISET.2 | 38.58,83.9 38.52,83.85 C58.2 R50.2 | R20.2 34.55,85.3 38.58,85.3
  Top 0.35: _FE1.26 43.12,84.6 v42.6,84.6 42.48,84.6 | 42.48,84.6 _FE1.PAD 39.23,84.6 | _FE1.25 42.48,84.6 | _FE1.20 39.23,84.6 | _FE1.18 37.92,84.6 | 37.92,84.6 38.58,84.6 | _FE1.10 38.58,85.3 38.58,84.6 | 38.58,84.6 39.1,84.6 39.23,84.6 | _FE1.12 37.27,85.6 37.27,84.6 37.92,84.6
  Top 1.5: 48.2,83.9 50.8,86.5 50.8,87 50,87.8 C50.2 50.5,90 55.12,90 C51.- | v42.6,84.6 44.8,84.6 46.2,83.2 47.5,83.2 48.2,83.9 | 48.2,83.9 C55.2 60.32,83.9 C56.- 61.92,84.3 C57.- 64.75,94.53 L3.2
  other vias: 37.6,85.6 38.6,85.6 39.6,85.6 40.6,85.6 41.6,85.6 42.6,85.6 37.6,84.6 37.6,83.6 38.6,84.6 38.6,83.6 39.6,84.6 39.6,83.6 40.6,84.6 40.6,83.6 41.6,84.6 41.6,83.6 42.6,83.6
  pour Top (isolate 0.3, rank 2, no thermals): 70.9,97.1 70.9,75.2 29.7,75.2 29.7,97.1
  pour Bottom (isolate 0.3, rank 2, no thermals): 70.9,97.1 70.9,75.2 29.7,75.2 29.7,97.1
INT
  Top 0.3: IC1.88 55.16,40.14 54.8,40.5 42.6,40.5 40.4,42.7 22.25,42.7 U$1.INT
IO4
  Top 0.3: JP14.4 38.59,58.59 R62.2
  Top 0.305: JP14.4 35.63,63.63 R25.1
IO4/CANTX
  Top 0.3: IC1.82 55.66,43.14 43.2,55.6 39.1,55.6 38.2,54.7 35.6,54.7 | U1.1 31.5,54.7 35.6,54.7 | R62.1 35.6,55.5 35.6,54.7
IO5
  Top 0.3: R63.2 35.38,60 JP14.5
  Top 0.305: JP14.5 33.57,63.15 R24.1
IO5/CANRX
  Top 0.25: 36.7,55.5 35.2,57
  Top 0.3: IC1.81 55.86,43.64 43.4,56.1 38.8,56.1 38.2,55.5 36.7,55.5 | U1.4 31.41,58.6 31.9,58.6 | 31.9,58.6 34.4,58.6 35.2,57.8 35.2,57 | R63.1 31.95,58.65 31.9,58.6
IO_LED3
  Top 0.3: 37.43,64.39 R26.1 | 54.35,45.85 41.13,59.07 JP14.3
  Top 0.305: IC1.80 56.06,44.14 54.35,45.85 | JP14.3 37.69,64.11 R26.1
IO_LED4
  Top 0.3: 39.97,64.43 R27.1 | 54.9,46.1 43.67,57.33 JP14.2
  Top 0.305: IC1.79 56.36,44.64 54.9,46.1 | JP14.2 39.75,64.59 R27.1
IO_LED5
  Top 0.3: 55.45,46.3 46.21,55.54 JP14.1
  Top 0.305: IC1.78 56.61,45.14 55.45,46.3 | JP14.1 42.23,64.65 R28.1
IR_AMP_BACK
  Top 0.3: R17.1 79.5,57.2 78.5,56.2 78.5,45.3 76.84,43.64 IC1.45
IR_AMP_FRONT
  Top 0.3: R53.1 79.5,45.5 77.14,43.14 IC1.44
IR_OPV_3V3  (via drill 0.3)
  Top 0.3: 6.73,8.98 7.49,9.74 T4.C | 6.73,8.98 9.75,5.95 12,5.95 12.95,5 83.6,5 84.25,4.35 86.85,4.35 87.88,5.38 91,8.5 91,10.66 T7.C | U$7.5 U$7.6 92.25,44.7 C49.2 v92.7,43.6 | C31.1 84.25,44.85 84,44.6 C31.1 | C31.1 v84.4,44.6 U$5.6 U$5.5 | 7.5,85 4.45,81.95 4.45,11.25 6.73,8.98 | 7.5,85 11.5,89 | 11.5,89 14,91.5 19.5,91.5 26.5,84.5 26.5,75.5 28,74 71.5,74 72,74.5 72,85 79.5,92.5 84,92.5 85.5,91 | 7.5,85 6.67,85.83 T2.C | 11.5,89 9.99,90.51 T3.C | 85.5,91 89.5,87 | 89.5,87 90.4,86.1 90.4,85.3 91.2,84.5 91.2,61.8 v87.6,58.2 | 12,6.51 T5.C | v87.6,56.4 86.5,55.3 86.5,44.5 | 86.5,44.5 v86.5,40.9 | 84.65,31.65 86.5,33.5 v86.5,39.3 90.8,39.3 v92.7,41.2 | v85.9,44.6 86.4,44.6 86.5,44.5 | T8.C 85.5,91.16 85.5,91 | 89.5,87 89.5,87.16 T9.C | 87.17,6.08 T6.C
  Top 0.305: 12,6.51 12,5.95 | 87.17,6.08 87.88,5.38
  Top 0.406: R23.2 79.95,32.8 81.9,32.8 82.9,31.8 IC5.5 83.8,31.5 C48.2 84.65,31.65 85.35,30.95 C30.1 88,30.7 R19.2
  Bottom 0.3: C45.2 5.12,85.83 T2.C | T4.C 6.02,9.83 C47.2 | T5.C 12.17,5.12 C46.2 | 85.83,92.87 T8.C | v87.6,58.2 v87.6,56.4 | v86.5,40.9 v86.5,39.3 | v84.4,44.6 v85.9,44.6 | v92.7,43.6 v92.7,41.2 | 91.88,88.17 T9.C
  Bottom 0.305: C39.2 91.88,88.17 | C40.2 90.49,10.71 T7.C | T6.C 87.15,6.46 C41.2 | 12.15,6.49 T5.C | 85.83,92.87 C38.2 | C37.2 9.8,90.54 T3.C
IR_VIRTUAL_GND  (via drill 0.3, 0.4)
  Top 0.25: 84.4,41 84.4,39
  Top 0.3: R38.1 84.15,49.45 C34.1 85.2,48.5 85.2,43.8 84.4,43 R39.1 84.4,41 | R43.1 92.65,49.4 | 92.65,49.4 C62.1 | 92.65,49.4 93.4,49.4 93.8,49 93.8,42.5 | 93.8,42.5 93.8,41.1 88.1,35.4 v87.3,35.4 | 84.4,39 84.4,35.8 v85.05,35.15 | R44.1 93.7,42.4 93.8,42.5
  Top 0.406: IC5.4 v81.7,31.5 | v83.1,32.9 82.9,33.1 IC5.1
  Bottom 0.3: v87.3,35.4 85.3,35.4 v85.05,35.15
  Bottom 0.406: v81.7,31.5 v83.1,32.9 85.05,34.85 v85.05,35.15
LED_EN  (via drill 0.3)
  Top 0.3: 64.21,54.06 64.21,63.81 | 67.9,67.5 79,67.5 81.1,69.6 v89.9,69.6 | v92.5,69.6 94.3,69.6 95.6,70.9 95.6,91.9 91.9,95.6 76.2,95.6 74.7,94.1 74.7,91.9 73.7,90.9 70.2,90.9 69.7,90.4 69.7,81.5 64.6,76.4 R46.1
  Top 0.305: IC1.66 64.21,54.06 | 64.21,63.81 65.1,64.7 65.1,65.6 67,67.5 67.9,67.5
  Bottom 0.3: v89.9,69.6 v92.5,69.6
LED_GREEN
  Top 0.3: IC1.69 62.71,56.69 62.2,57.2 58.85,57.2 R59.2
LED_RED
  Top 0.3: IC1.68 63.21,56.94 R57.2
LED_YELLOW
  Top 0.3: IC1.70 62.21,56.49 62,56.7 54.15,56.7 R61.2
MIC1
  Top 0.3: IC1.15 66.71,28.16 C7.1 R7.1
MIC2
  Top 0.3: IC1.16 67.21,27.81 66.6,27.2 66.6,24.4 66.3,24.1 C8.1 R11.1
MIC3
  Top 0.3: IC1.17 67.71,27.61 67.1,27 67.1,21.8 | 67.1,21.8 67.1,20.45 R12.1 | C9.1 67.1,21.8
MIC4
  Top 0.3: IC1.18 68.21,27.41 67.6,26.8 67.6,24.6 | 67.6,24.6 67.6,23.65 R13.1 | C26.1 67.7,24.5 67.6,24.6
N$1
  Top 0.3: X1.3 83.34,70.8 77.5,70.8 75.6,68.9 48.1,68.9 47.5,68.3 47.5,62.8 48.2,62.1 48.2,55.4 50.7,52.9 60.7,52.9 61.21,52.39 IC1.72
N$2
  Top 0.3: X1.1 82.96,75.5 81.5,75.5 75.4,69.4 47.9,69.4 47,68.5 47,62.6 47.7,61.9 47.7,55.2 56.76,46.14 IC1.76
N$3
  Top 0.3: IC2.1 81.78,27.82 80.15,29.45 80.15,29.63 IC2.4 79.6,29.72 79.6,30.45 77.8,32.25 77.8,35.9 76.94,36.76 R3.2
N$4
  Top 0.3: IC2.3 82.72,29.78 84.55,29.78 | 84.29,29.8 C1.1 84.57,29.76 84.55,29.78 | 84.55,29.78 85.65,29.78 R2.2 87.71,27.72 R1.1
N$6
  Top 0.3: U$4.1 92.53,18.33 91.95,17.75 91.95,15.95 92.3,15.6 93.9,15.6 94.25,15.95 94.25,16.29 C42.1
  Top 0.6: C42.1 94.43,17.07 U$4.3 95.48,18.67 R14.1
N$7
  Top 0.61: 86.69,23.75 IC4.3 87.75,23.75 | C3.1 88.7,22.83 88.7,23.2 88.15,23.75 87.75,23.75 | R4.1 87.75,25.01 87.75,23.75
N$8
  Top 0.3: IC1.73 60.71,51 C10.1
N$9
  Bottom 0.6: IC3.3 61.97,34.83 61.25,35.55 61.25,36.3 | 61.25,36.3 61.25,36.75 60.15,37.85 59.84,37.85 C5.1 | R5.1 61.23,36.32 61.25,36.3
N$10
  Top 0.3: Q2.2 91,53.55 R16.1
N$11
  Top 0.3: IC1.49 75.42,45.64 C11.1
N$12
  Top 0.3: Q2.1 91.5,56.6 90.9,57.2 R17.2
N$13
  Top 0.3: R7.2 63.8,25.6 62.6,24.4 62.6,19.1 58.4,14.9 19.4,14.9 16.5,17.8 14.4,17.8 9.3,22.9 9.3,69.3 11.4,71.4 74.6,71.4 82.7,79.5 82.7,86.29 JP7.4
N$14  (via drill 0.4)
  Top 0.3: IC1.21 69.71,30.49 70.2,30 70.2,28.85 70.74,28.31 C21.2 70.83,27.41 | C22.2 70.8,26.55 70.83,27.41 | v70.9,27.4 70.84,27.4 70.83,27.41
  Bottom 0.3: R6.1 74.5,27.1 74.1,27.5 71,27.5 v70.9,27.4
N$15  (via drill 0.4)
  Top 0.3: IC1.12 65.21,30.99 v65.4,30.8
  Bottom 0.3: v65.4,30.8 65.4,32.42 Q1.3
N$16
  Bottom 0.3: R8.2 67.8,41.6 C24.1 67.52,39.3 C23.1 67.45,37.49 67.45,36.9 65.99,35.44 Q1.4
N$17
  Top 0.3: JP9.4 17.5,11.2 17.8,10.9 61,10.9 68.75,18.65 R12.2 68.7,20.35
N$19
  Top 0.3: IC1.14 66.21,29.42 R10.1
N$20
  Top 0.3: JP8.4 11.2,80.5 7.3,76.6 7.3,22.1 13.6,15.8 15.7,15.8 18.6,12.9 60.2,12.9 63.6,16.3 63.6,22.25 R11.2
N$21
  Top 0.3: 70.2,22.7 69.85,23.05 R13.2 70.2,22.75 71.45,22.75 77.1,17.1 84.49,17.1 JP10.4
N$22  (via drill 0.3)
  Top 0.3: IC1.94 55.06,37.14 v54.7,37.5 | v54,30.6 53.3,31.3 BT1.2 BT1.4
  Bottom 0.3: v54.7,37.5 55,37.2 55,31.6 v54,30.6 53.44,30.04 R9.2
N$23  (via drill 0.3)
  Top 0.3: IC1.83 55.24,42.64 v55.1,42.6 | 52.7,42.1 v52.9,42.1 51.35,42.1 R54.1
  Bottom 0.3: v55.1,42.6 53.4,42.6 v52.9,42.1
N$27
  Top 0.6: U$4.4 94.43,21.43 94.55,21.55 95.55,21.55 C43.1
N$29
  Top 0.3: U$1.VIN 14.95,28.54 R15.1
  Top 0.61: 15.03,29.18 R15.1 15.2,29.35 C27.1
N$31
  Top 0.3: R54.2 R55.2 | R55.2 49.55,43.75 49.2,44.1 | X2.2 26.49,45.5 47.75,45.5 R55.2
N$32
  Top 0.3: T10.4 59.4,59.4 59.6,59.6 59.9,59.6 T10.2 59.9,61.25 R56.2
N$33
  Top 0.25: 39.1,80.3 39.1,77 39.3,76.8 42.4,76.8 42.6,77 44.85,77 R46.2
  Top 0.3: _FE1.21 39.9,81.67 39.9,80.8 39.6,80.5 39.3,80.5 39.1,80.3
N$38
  Top 0.3: T2.E 7.49,89.99 9.5,92 12,92 | 12,92 19.7,92 27,84.7 27,75.7 28.2,74.5 71.3,74.5 71.5,74.7 71.5,85.2 79.3,93 87.4,93 88.95,91.45 | 88.95,91.45 91.7,88.7 91.7,86 | T3.E 12,91.66 12,92 | T8.E 88.95,91.29 88.95,91.45 | T9.E 91.66,86 91.7,86 | R42.2 C53.1 89.65,52.4 90.2,52.4 90.85,51.75 R16.2 92.5,53.15 92.5,56.8 91.7,57.6 91.7,86
N$39
  Top 0.3: U$5.3 80.95,49.25 | 80.95,49.25 R38.2 | 80.95,49.25 80.95,50.85 C35.2
N$40
  Top 0.3: Q3.2 R52.1
N$41
  Top 0.3: U$5.1 82.85,46.25 82.5,45.9 80.6,45.9 80.1,45.4 80.1,43.55 R22.2 79.5,42 | R40.2 79.35,42.15 79.5,42 | C32.2 79.5,42
N$42
  Top 0.3: U$5.4 80.95,43.2 R22.1 | R22.1 C32.1 | R22.1 R39.2
N$43
  Top 1.5: L2.1 67.7,89.48 C57.+ 66.05,92.28 L3.3
N$44
  Top 0.3: Q3.1 83.4,55.9 82.8,56.5 79.65,56.5 79.2,56.05 79.2,54.15 R53.2
N$45
  Top 0.406: C33.2 R29.2 79.75,34.3 R23.1 79.65,34.1 IC5.3
N$48
  Top 0.3: IC1.95 37.94,36.64 26.6,25.3 24.41,25.3 U$1.SCL
N$49
  Top 0.3: IC1.96 38.24,36.14 26.8,24.7 24.1,24.7 23.4,25.4 21.77,25.4 U$1.SDA
N$50
  Top 0.3: R57.1 61.25,58.9 T10.6 T10.5
N$55
  Top 0.3: _FE1.15 34.95,81.7 | 34.95,81.7 C58.1 | C59.1 34.75,81.5 34.95,81.7
N$56
  Top 0.3: _FE1.2 43.77,92.9 45.1,92.9
  Top 1.5: D1.C 46.8,92.9 | 46.8,92.9 47.6,92.1 50,92.1 | 50,92.1 54.1,92.1 55.2,93.2 C51.+ | C50.1 50,92.1 | JP11.1 45.1,92.9 46.8,92.9
N$57
  Top 0.3: U$7.1 91.25,46.35 90.9,46 88.9,46 88.5,45.6 88.5,44 87.95,43.45 R41.2 C52.2 86.55,40 R45.2
N$58
  Top 0.3: 89.2,45.1 89.35,44.95 U$7.4 89.4,44.65 89.4,43.3 | 89.4,43.3 89.65,43.05 R41.1 89.85,42.7 90.9,42.7 91.05,42.55 R44.2 | 89.4,43.3 89.4,41.65 C52.1
N$59
  Top 0.3: 42.15,88.05 42.15,87.83 _FE1.4 _FE1.5
  Top 1: JP11.2 40.4,91.4 42.15,89.65 42.15,88.05
N$60
  Top 0.25: 85,58 85,53.55
  Top 0.3: 7.27,12.98 11.5,8.75 | 11.5,8.75 14.74,5.51 T6.E 84.85,5.54 84.85,5.7 87.98,8.83 T7.E | T4.E 6.51,12.21 7.27,12.98 | T5.E 10.24,7.49 11.5,8.75 | 7.27,12.98 5.05,15.2 5.05,81.75 14.3,91 19.3,91 26,84.3 26,75.3 27.8,73.5 71.7,73.5 72.5,74.3 72.5,84.8 79.7,92 83.8,92 89.9,85.9 89.9,85.1 90.7,84.3 90.7,63.7 85,58 | R37.2 C35.1 82.25,51.45 R52.2 85,53.55
N$61
  Top 0.3: U$7.3 89.35,48.4 | 89.35,48.4 R43.2 | C53.2 89.25,48.5 89.35,48.4
N$62
  Top 0.3: _FE1.6 _FE1.7 40.85,87.83 40.85,88.05
  Top 1: JP11.3 37.86,91.99 40.85,89 40.85,88.05
N$64
  Top 0.3: IC1.86 55.56,41.14 50.7,46 26.8,46 24.3,48.5 24.3,50.8 22.84,52.26 X2.3
N$65
  Top 0.3: IC1.87 55.36,40.64 52.3,43.7 R55.1
N$66
  Top 0.3: 83.35,62.5 X3.3 | 83,62.5 83.38,62.12 X3.3 | X3.3 81.31,64.1 71.9,64.1 70.2,62.4 70.2,57.3 69.71,56.81 IC1.55
N$67
  Top 0.3: X3.2 71.7,64.57 69.7,62.57 69.7,57.5 69.21,57.01 IC1.56
N$68
  Top 0.3: T10.3 59.4,64.17 JP3.2
N$69
  Top 0.3: _FE1.16 36.62,80.62 35.5,79.5 32.3,79.5 31.9,79.9 31.9,84.45 R20.1 34.5,91.35 R18.2
N$70
  Top 0.3: R18.1 36.35,94.15 37,94.8 41.1,94.8 41.7,94.2 41.7,91.5 43.1,90.1 43.1,87.53 _FE1.3
N$71
  Top 0.3: _FE1.9 39.23,88.88 TP1.TP
N$72
  Top 0.3: _FE1.11 37.92,88.92 TP2.TP
N$73
  Top 0.3: R24.2 33.57,67.51 LED_RED.C
N$74
  Top 0.3: R25.2 LED_YEL.C
N$75
  Top 0.3: R26.2 LED_GRE.C
N$76
  Top 0.3: R27.2 39.75,67.51 LED_WHT.C
N$77
  Top 0.3: R28.2 LED_BLU.C
N$78  (via drill 0.4)
  Top 0.3: R30.2 62.35,26.75 v61.4,25.8 | v57.35,26.1 57.35,27.16 LED7.C
  Bottom 0.3: v61.4,25.8 57.65,25.8 v57.35,26.1
N$79
  Top 0.3: R31.2 57.92,28.59 LED8.C
N$80
  Top 0.3: IC1.3 60.71,28.85 60.3,28.85 R31.1 60,28.29 60,27.95 59.7,27.65 59.2,27.65 58.65,27.1 R35.1
N$81
  Top 0.3: _FE1.17 37.27,78.42 37.6,78.1 37.95,78.1 R47.1 38.3,77.75 38.3,77 39.15,76.15 R48.2
N$82
  Top 0.3: IC1.5 61.71,29.11 R30.1
N$83
  Top 0.25: 42.3,80.3 42.3,78.7
  Top 0.3: _FE1.24 41.83,80.78 42.3,80.3 | 42.3,78.7 42,78.4 40.5,78.4 40.1,78 40.1,77.55 R47.2
N$84
  Top 0.3: T1.2 | 58.25,22.1 R32.1 60.3,23.98 R34.2
  Top 0.6: T1.2 58.03,22.14 R32.1
N$85
  Top 0.3: R33.1 55.58,24.67 55.6,24.65 56.14,24.65 T1.4 57.94,24.68 R35.2
N$86
  Top 0.61: JP5.2 47.92,21.22 48.85,22.15 T1.7
N$87
  Top 0.3: IC1.4 61.21,27.56 R34.1
N$88  (via drill 0.4)
  Top 0.3: IC1.22 70.21,30.74 71.43,29.52 C19.1 72.39,29.44 C20.1
  Top 0.6: v73.95,29.7 74,29.52 C20.1
  Bottom 0.6: R36.1 74.6,29.05 v73.95,29.7
N$89
  Top 0.61: T1.5 46.28,24.68 42.3,20.7 42.3,18.98 JP6.2
N$90
  Top 0.3: IC1.2 60.21,31.11 59.9,30.8 55.9,30.8 54.7,32 54.7,33 53.6,34.1 39.3,34.1 38.5,33.3 38.5,22.7 37.3,21.5 36.22,21.5 SW1.7
N$91
  Top 0.3: _FE1.27 43.77,80.78 44.88,79.67 | 44.88,79.67 45.05,79.5 R21.2 45.25,79.5 | 44.88,79.67 44.88,79.38 43.5,78 R48.1
N$94
  Top 0.3: _FE1.28 44.42,80.97 44.7,80.7 46.7,80.7 | 46.7,80.7 52.9,80.7 L1.1 | R21.1 46.7,78.4 46.7,80.7
  Top 1.5: L1.1 55.26,81.1 C55.1 62.28,81.1 C56.+ 65.58,84.4 L2.2
N$95
  Top 0.3: IC1.97 38.54,35.64 30.2,27.3 30.2,22.4 33.7,18.9 SW1.5
N$96
  Top 0.3: IC1.98 38.84,35.14 30.8,27.1 30.8,22.7 33.34,20.16 SW1.6
N$97
  Top 0.3: _FE1.22 40.52,79.97 R49.2
N$98
  Top 0.3: IC1.1 59.71,31.46 59.55,31.3 56.1,31.3 55.2,32.2 55.2,33.3 53.9,34.6 39.1,34.6 38,33.5 38,23.5 37.2,22.7 SW1.8
N$99
  Top 0.3: _FE1.23 41.17,79.67 C60.1
N$100
  Top 0.3: C59.2 33.05,82.1 R50.1
N$101
  Top 0.3: _FE1.13 36.62,89.88 36.2,90.3 35.95,90.3 R_ISET.1
N$102
  Top 0.3: R51.1 27.45,53.95 26.6,54.8 25.26,54.8 U1.8
N$103
  Top 0.3: J1.3 23.34,64.5 24.5,64.5 24.8,64.2 24.8,62.9 24.2,62.3 20.8,62.3 19.6,61.1 19.6,57.3 20.5,56.4 21.4,56.4 22.3,55.5 J2.3 23.04,56.1 U1.7
N$104
  Top 0.3: J1.2 22.3,65.9 23.1,65.1 24.8,65.1 25.4,64.5 25.4,62.6 24.5,61.7 21,61.7 20.2,60.9 20.2,57.5 20.7,57 21.4,57 J2.2 22.83,57.37 U1.6
N$109
  Top 0.3: T11.4 55.4,59.4 55.6,59.6 55.9,59.6 T11.2 55.9,61.35 R58.2
N$110
  Top 0.3: T11.5 T11.6 57.15,58.9 R59.1
N$111
  Top 0.3: T11.3 55.4,65.93 JP4.2
N$113
  Top 0.3: T12.4 49.5,59.4 49.7,59.6 50,59.6 T12.2 50,61.35 R60.2
N$114
  Top 0.3: T12.6 T12.5 51.15,58.9 R61.1
N$115
  Top 0.3: T12.3 49.5,65.63 JP12.2
N$116  (via drill 0.3)
  Top 0.3: IC1.51 71.71,54.11 v71.9,54.3
  Bottom 0.3: v71.9,54.3 71.9,55.74 CON1.4
N$117
  Top 0.3: IC1.52 71.21,54.71 72.4,55.9 74.1,55.9 74.6,56.4 74.6,58 75.7,59.1 75.7,59.54 CON1.5
N$118
  Top 0.3: IC1.53 70.71,56.31 72.8,58.4 73.9,58.4 74.6,59.1 74.6,60.98 CON1.7
N$119
  Top 0.3: IC1.54 70.21,56.59 CON1.6
N$127
  Top 0.3: IC1.48 76.44,45.14 77.1,45.8 77.1,56.1 76.03,57.17 CON1.3
N$128
  Top 0.3: IC1.47 76.74,44.64 77.7,45.6 77.7,62.1 76.4,63.4 74.48,63.4 CON1.8
N$129
  Top 0.3: CON1.2 74.35,53.61 C66.1 72.95,52.4 R64.1
PS0
  Top 0.3: IC1.92 55.76,38.14 54.4,39.5 42.2,39.5 40,41.7 18.18,41.7 U$1.PS0
PS1
  Top 0.3: IC1.91 55.96,38.64 54.6,40 42.4,40 40.2,42.2 20.21,42.2 U$1.PS1
RST
  Top 0.3: IC1.93 55.56,37.64 54.2,39 39.5,39 27,26.5 25.75,26.5 U$1.RST

## Text on the board
_tsilk: 2 | BACK | - | - | + | 1 | IR-LED | SWD | LED / YEL | LED / GRE | LED / RED | 1 | 2 | 3 | 4 | 5 | CAN / IN | - | + | + | + | CAN / OUT | BAT-RF | - | UART / RF | DB / UART | DAC(12-) | BAT-LOW | Buzzer | LED | - | + | 3 | FRONT | 4
_bsilk: CAN / IN | CAN / OUT | UART / RF | 5.5-8V